# EAGLE design CAN-BUS Shield  v1.2 (EAGLE 7.1.0)
DESCRIPTION: microOBD 200 OBD-II Module; HW_REV: 1.4; PCB_REV: C; PCB_SPEC1: Layer Count: 4; PCB_SPEC2: Size: 1.3" x 0.59"; PCB_SPEC3: Finish Thickness: 0.049" - 0.052"; PCB_SPEC4: Copper Weight: 1oz; TITLE: STM1120

## Sheet 1 of 2
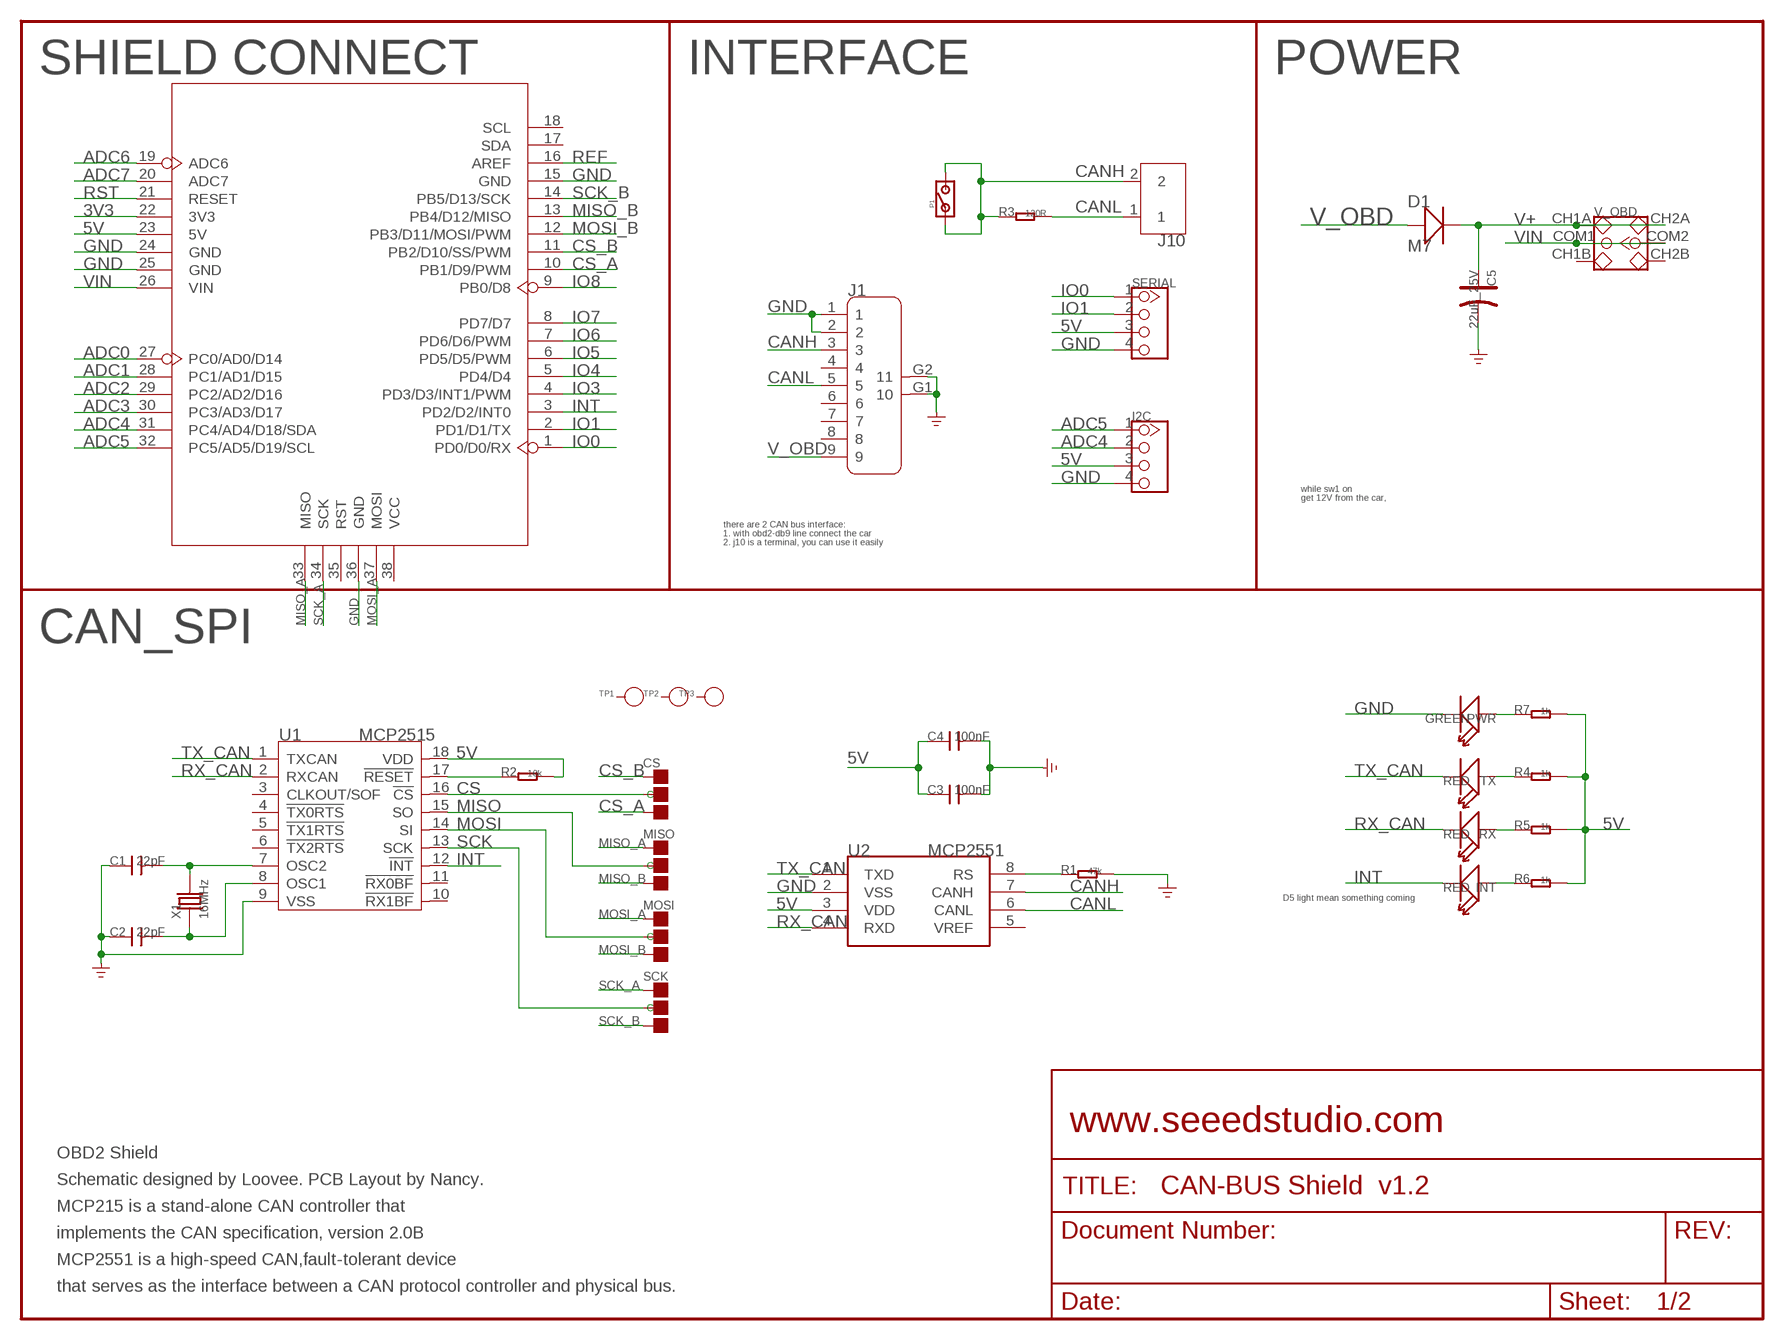
[diagram p0: schematic, sheet 1]

### Parts
C1  22pF  C-0603  [0603]
C2  22pF  C-0603  [0603]
C3  100nF  C-0603  [0603]
C4  100nF  C-0603  [0603]
C5  22uF_25V  CAP-ELECTRO-B  [ELECTRO-SMD-B-4.8MM]
CS  PAD-JUMPER-3P-40*40  [3P-SMD-4.1X1.5]
D1  M7  D-SMA  [D2010]
I2C  TWIG-4P-2.0-2.0  [4P-2.0]
INT  RED  LED'0603'  [LED-0603]
J1  DB9'MEAL'  [DB9-MEAL]
J10  SCREW-TERMINAL-2P5.0  [2P-5.0]
MISO  PAD-JUMPER-3P-40*40  [3P-SMD-4.1X1.5]
MOSI  PAD-JUMPER-3P-40*40  [3P-SMD-4.1X1.5]
P1  PAD-JUMPER-2P  [2P-SMD-1.78X1.27]
PWR  GREEN  LED'0603'  [LED-0603]
R1  47k  R-0603  [0603]
R2  10k  R-0603  [0603]
R3  120R  R-0603  [0603]
R4  1k  R-0603  [0603]
R5  1k  R-0603  [0603]
R6  1k  R-0603  [0603]
R7  1k  R-0603  [0603]
RX  RED  LED'0603'  [LED-0603]
SCK  PAD-JUMPER-3P-40*40  [3P-SMD-4.1X1.5]
SERIAL  TWIG-4P-2.0-2.0  [4P-2.0]
TP1  PAD-TEST-POINT'4545'  [TP_4545]
TP2  PAD-TEST-POINT'4545'  [TP_4545]
TP3  PAD-TEST-POINT'4545'  [TP_4545]
TX  RED  LED'0603'  [LED-0603]
U1  MCP2515  MCP2515-SOIC18  [SOIC18]
U2  MCP2551  MCP2551-SOIC8  [SOIC8-6.0]
U4  ARDUINO-38P'WITH/-SILK'  [ARDUINO-38P-WITH/-SILK-500519002]
V_OBD  SWITCH-2CH-6P  [6P-2CH-2.54-7.6X3.0]
X1  16MHz  CRYSTAL-HC49S  [HC49/S]

### Nets
3V3: U4.22(3V3)
5V: C3.1 C4.1 I2C.3 R2.2 R4.2 R5.2 R6.2 R7.2 SERIAL.3 U1.18(VDD) U2.3(VDD) U4.23(5V)
ADC0: U4.27(PC0/AD0/D14)
ADC1: U4.28(PC1/AD1/D15)
ADC2: U4.29(PC2/AD2/D16)
ADC3: U4.30(PC3/AD3/D17)
ADC4: I2C.2 U4.31(PC4/AD4/D18/SDA)
ADC5: I2C.1 U4.32(PC5/AD5/D19/SCL)
ADC6: U4.19(ADC6)
ADC7: U4.20(ADC7)
CANH: J1.3 J10.2 P1.1 P1.2 R3.1 U2.7(CANH)
CANL: J1.5 J10.1 R3.2 U2.6(CANL)
CS: CS.MM(C) U1.16(!CS)
CS_A: CS.11(R) U4.10(PB1/D9/PWM)
CS_B: CS.00(L) U4.11(PB2/D10/SS/PWM)
GND: C1.1 C2.1 C3.2 C4.2 C5.- I2C.4 J1.1 J1.2 J1.G1 J1.G2 PWR.- R1.2 SERIAL.4 U1.9(VSS) U2.2(VSS) U4.15(GND) U4.24(GND) U4.25(GND) U4.36(GND)
INT: INT.- U1.12(!INT) U4.3(PD2/D2/INT0)
IO0: SERIAL.1 U4.1(PD0/D0/RX)
IO1: SERIAL.2 U4.2(PD1/D1/TX)
IO3: U4.4(PD3/D3/INT1/PWM)
IO4: U4.5(PD4/D4)
IO5: U4.6(PD5/D5/PWM)
IO6: U4.7(PD6/D6/PWM)
IO7: U4.8(PD7/D7)
IO8: U4.9(PB0/D8)
MISO: MISO.MM(C) U1.15(SO)
MISO_A: MISO.00(L) U4.33(MISO)
MISO_B: MISO.11(R) U4.13(PB4/D12/MISO)
MOSI: MOSI.MM(C) U1.14(SI)
MOSI_A: MOSI.00(L) U4.37(MOSI)
MOSI_B: MOSI.11(R) U4.12(PB3/D11/MOSI/PWM)
N$1: PWR.+ R7.1
N$2: R4.1 TX.+
N$15: R5.1 RX.+
N$16: C1.2 U1.7(OSC2) X1.2
N$17: C2.2 U1.8(OSC1) X1.1
N$19: INT.+ R6.1
N$20: R1.1 U2.8(RS)
REF: U4.16(AREF)
RST: U4.21(RESET)
RST_N: R2.1 U1.17(!RESET)
RX_CAN: RX.- U1.2(RXCAN) U2.4(RXD)
SCK: SCK.MM(C) U1.13(SCK)
SCK_A: SCK.00(L) U4.34(SCK)
SCK_B: SCK.11(R) U4.14(PB5/D13/SCK)
TX_CAN: TX.- U1.1(TXCAN) U2.1(TXD)
V+: C5.+ D1.- V_OBD.CH1A V_OBD.CH2A
V_OBD: D1.+ J1.9
VIN: U4.26(VIN) V_OBD.COM1 V_OBD.COM2
Unconnected: J1.4 J1.6 J1.7 J1.8 TP1.T TP2.T TP3.T U1.3(CLKOUT/SOF) U1.4(!TX0RTS) U1.5(!TX1RTS) U1.6(!TX2RTS) U1.10(!RX1BF) U1.11(!RX0BF) U2.5(VREF) U4.17(SDA) U4.18(SCL) U4.35(RST) U4.38(VCC) V_OBD.CH1B V_OBD.CH2B

### Notes on the sheet
- SHIELD CONNECT | INTERFACE | POWER
- while sw1 on
- get 12V from the car,
- there are 2 CAN bus interface:
- 1. with obd2-db9 line connect the car
- 2. j10 is a terminal, you can use it easily
- CAN_SPI
- D5 light mean something coming
- www.seeedstudio.com
- OBD2 Shield
- Schematic designed by Loovee. PCB Layout by Nancy.
- MCP215 is a stand-alone CAN controller that
- implements the CAN specification, version 2.0B
- MCP2551 is a high-speed CAN,fault-tolerant device
- that serves as the interface between a CAN protocol controller and physical bus.

## Sheet 2 of 2

## Library data of the parts
C1-C4 = Discrete:C*: Ceramic Capacitors
C5 = Discrete:CAP*: Electrolytic Capacitors,Tantalum Capacitors and Super Capacitors
CS MISO MOSI SCK = Discrete:PAD-JUMPER-3P
D1 = Discrete:D*
I2C SERIAL = Connector:TWIG-4P-2.0
INT PWR RX TX = Discrete:LED*
J1 = Connector:DB9
J10 = Connector:SCREW-TERMINAL-2P
P1 = Discrete:PAD-JUMPER-2P
R1-R7 = Discrete:R*
TP1-TP3 = Discrete:PAD-TEST-POINT; PARTNO: DNP
U1 = IC:MCP2515: Stand-Alone CAN Controller With SPI Interface
U2 = IC:MCP2551: High-Speed CAN Transceiver http://ww1.microchip.com/downloads/en/devicedoc/21667f.pdf
U4 = moudle:ARDUINO-38P
V_OBD = Discrete:SWITCH-2CH-6P
X1 = Discrete:CRYSTAL*: CRYSTAL

## Net classes
0 default: width 0.152 mm, drill 0.305 mm, clearance 0.152 mm

## Board
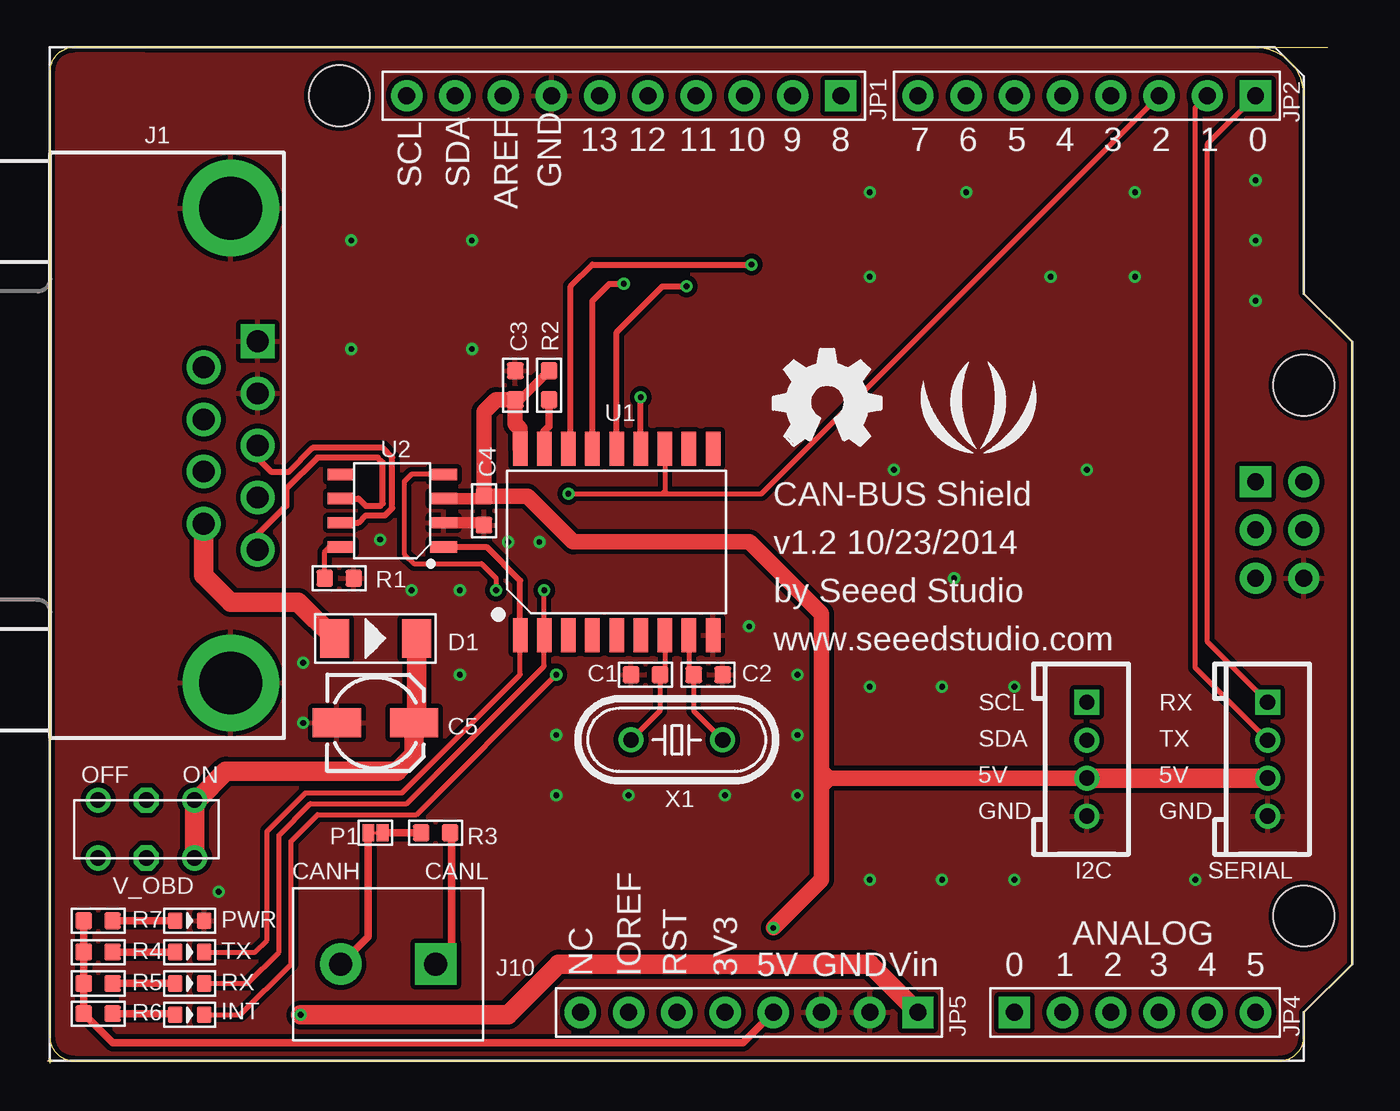
[diagram p1: board, top side]
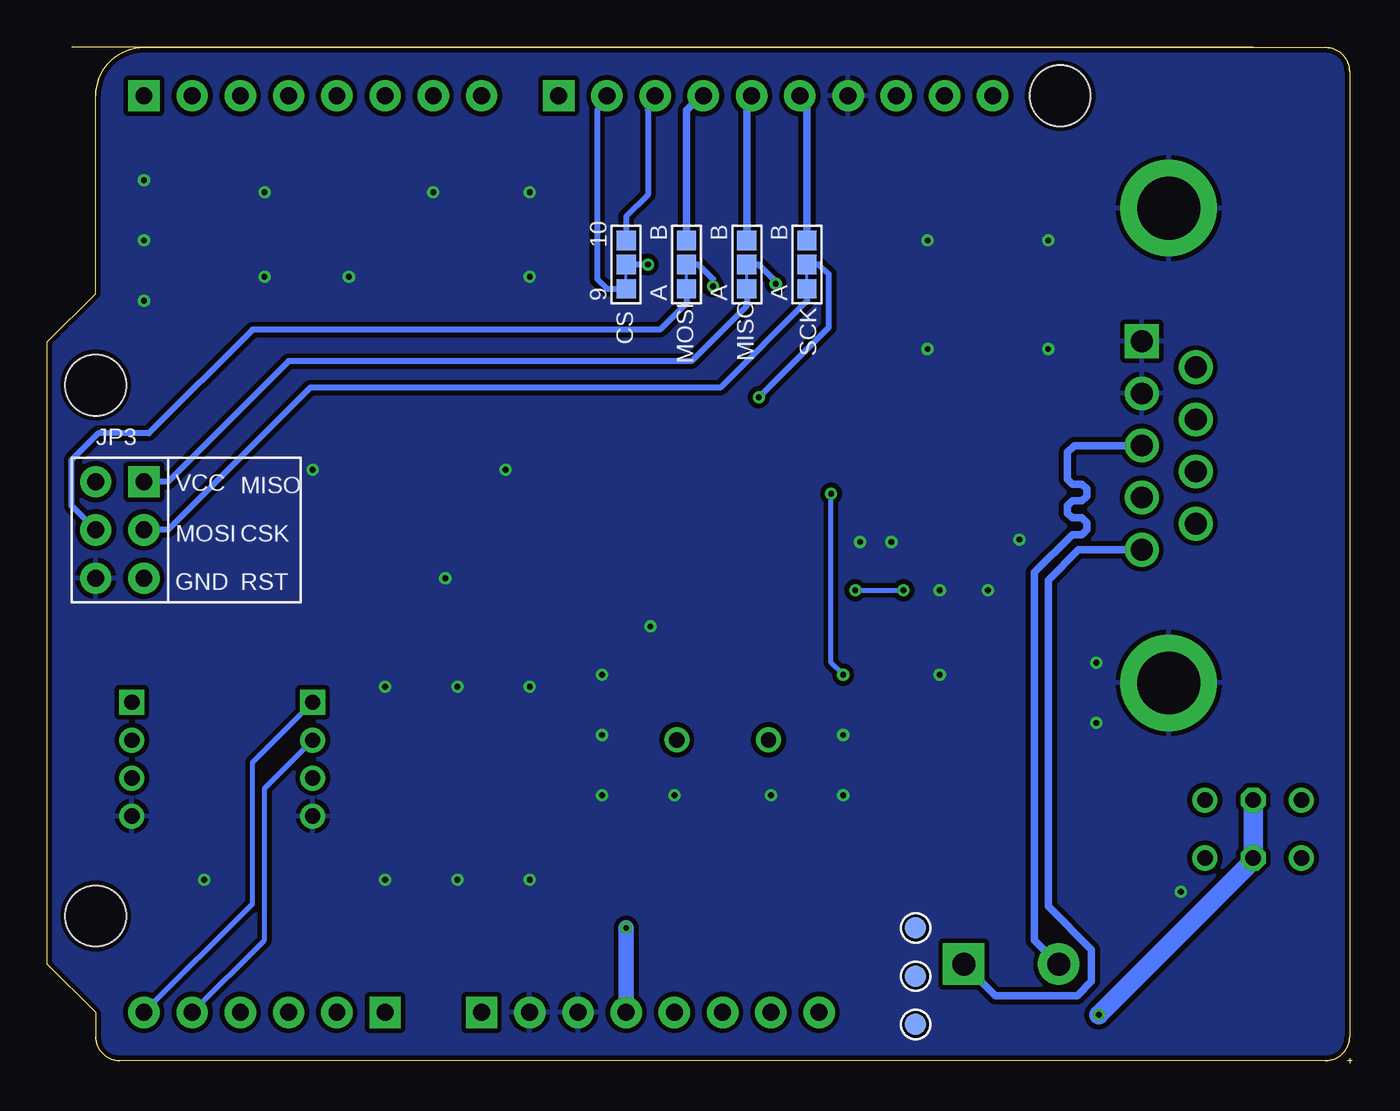
[diagram p2: board, bottom side, seen from below]

Size 68.71 x 53.47 mm. Coordinates in mm from the lower left corner, seen from the top.
Outline: 66.17,1.4 arc-90 64.9,0.13
Outline: 1.4,0.13 arc-90 0.13,1.4
Outline: 0.13,52.2 arc-90 1.4,53.47
Outline: 63.63,53.47 arc-90 66.17,50.93
Outline: 5.21,53.47 67.44,53.47
Outline: 0.13,1.4 arc90 1.4,0.13
Outline: 64.9,0.13 arc90 66.17,1.4
Outline: 1.4,53.47 arc90 0.13,52.2
Outline: 0.13,1.4 arc90 1.4,0.13
Outline: 64.9,0.13 arc90 66.17,1.4
Outline: 66.17,50.93 arc90 63.63,53.47
Outline: 66.17,1.4 66.17,2.67 68.71,5.21 68.71,37.97 66.17,40.51 66.17,50.93
Outline: 66.17,1.4 arc-90 64.9,0.13
Outline: 63.63,53.47 1.4,53.47
Outline: 1.4,53.47 arc90 0.13,52.2
Outline: 0.13,52.2 0.13,1.4
Outline: 0.13,1.4 arc90 1.4,0.13
Outline: 66.17,50.93 arc90 63.63,53.47
Outline: 1.4,0.13 64.9,0.13
Outline: 0,0.13 0.25,0.13
Outline: 0.13,0.25 0.13,0
Copper layers (1*16): Top 0.035mm / dielectric 1.5mm / Bottom 0.035mm
Design rules "SeeedStudio_2layer_DRU_no_angle_20140221 *": minimum track width 6mil, minimum drill 12mil, track to track 6mil, track to pad 6mil, pad to pad 6mil, via to via 6mil, smd to smd 0mil, copper to edge 10mil, drill to drill 10mil, minimum pad ring 10mil, minimum via ring 6mil, stop-mask expansion 2mil, vias tented up to drill 100mil, thermal gap 10mil

### Footprints (pad centres in the part's own frame; a part is rotated, then mirrored left to right if it is on the bottom)
0603 = smd 0.889 x 0.889: 1 -0.762,0; 2 0.762,0
ELECTRO-SMD-B-4.8MM = smd 2.54 x 1.524: + 2.032,0; - -2.032,0
3P-SMD-4.1X1.5 = smd 1.016 x 1.016: 00 -1.27,0; 11 1.27,0; MM 0,0
D2010 = smd 1.524 x 2.032: + -2.159,0; - 2.159,0
4P-2.0 = drill 0.8 pad 1.27 square: 1 -3,0 | drill 0.8 pad 1.27: 2 -1,0; 3 1,0; 4 3,0
LED-0603 = smd 0.762 x 0.889: + -0.762,0; - 0.762,0
DB9-MEAL = drill 1.143 pad 1.778 square: 1 -5.486,1.422 | drill 1.143 pad 1.778: 2 -2.743,1.422; 3 0,1.422; 4 2.743,1.422; 5 5.486,1.422; 6 -4.115,-1.422; 7 -1.372,-1.422; 8 1.372,-1.422; 9 4.115,-1.422 | drill 3.302 pad 5.08: G1 12.497,0; G2 -12.497,0
2P-5.0 = drill 1.2 pad 2.184 square: 1 0,0 | drill 1.2 pad 2.184: 2 5,0
2P-SMD-1.78X1.27 = smd 0.889 x 0.61: 1 0,0.381; 2 0,-0.381
TP_4545 = smd 1.143 x 1.143: T 0,0
SOIC18 = smd 0.762 x 1.778: 1 -5.08,-4.915; 2 -3.81,-4.915; 3 -2.54,-4.915; 4 -1.27,-4.915; 5 0,-4.915; 6 1.27,-4.915; 7 2.54,-4.915; 8 3.81,-4.915; 9 5.08,-4.915; 10 5.08,4.915; 11 3.81,4.915; 12 2.54,4.915; 13 1.27,4.915; 14 0,4.915; 15 -1.27,4.915; 16 -2.54,4.915; 17 -3.81,4.915; 18 -5.08,4.915
SOIC8-6.0 = smd 0.6 x 1.4: 1 -1.905,-2.7; 2 -0.635,-2.7; 3 0.635,-2.7; 4 1.905,-2.7; 5 1.905,2.7; 6 0.635,2.7; 7 -0.635,2.7; 8 -1.905,2.7
ARDUINO-38P-WITH/-SILK-500519002 = drill 0.889 pad 1.651 square: 1 63.5,50.8; 9 41.656,50.8; 26 45.72,2.54; 27 50.8,2.54; 33 63.5,30.48 | drill 0.889 pad 1.651: 2 60.96,50.8; 3 58.42,50.8; 4 55.88,50.8; 5 53.34,50.8; 6 50.8,50.8; 7 48.26,50.8; 8 45.72,50.8; 10 39.116,50.8; 11 36.576,50.8; 12 34.036,50.8; 13 31.496,50.8; 14 28.956,50.8; 15 26.416,50.8; 16 23.876,50.8; 17 21.336,50.8; 18 18.796,50.8; 19 27.94,2.54; 20 30.48,2.54; 21 33.02,2.54; 22 35.56,2.54; 23 38.1,2.54; 24 40.64,2.54; 25 43.18,2.54; 28 53.34,2.54; 29 55.88,2.54; 30 58.42,2.54; 31 60.96,2.54; 32 63.5,2.54; 34 63.5,27.94; 35 63.5,25.4; 36 66.04,25.4; 37 66.04,27.94; 38 66.04,30.48 | hole 3.2: 15.24,50.8; 66.04,35.56; 66.04,7.62
6P-2CH-2.54-7.6X3.0 = drill 0.813 pad 1.27: CH1A -1.524,2.54; CH1B -1.524,-2.54; CH2A 1.524,2.54; CH2B 1.524,-2.54 | drill 0.813 pad 1.27 octagon: COM1 -1.524,0; COM2 1.524,0
HC49/S = drill 0.813: 1 -2.413,0; 2 2.413,0

### Placement (x,y rotation side)
C1  31.5,20.45 0 top
C2  34.8,20.45 180 top
C3  24.64,35.69 90 top
C4  22.99,29.08 270 top
C5  17.27,17.91 0 top
CS  38.23,42.04 270 bottom
D1  17.27,22.35 0 top
I2C  54.74,16 270 top
INT  7.49,2.54 0 top
J1  9.65,32.51 270 top
J10  20.45,5.21 180 top
MISO  31.88,42.04 90 bottom
MOSI  35.05,42.04 90 bottom
P1  17.27,12.13 90 top
PWR  7.49,7.49 0 top
R1  15.37,25.53 0 top
R2  26.42,35.69 90 top
R3  20.45,12.13 0 top
R4  2.67,5.84 180 top
R5  2.67,4.19 180 top
R6  2.67,2.6 180 top
R7  2.67,7.49 180 top
RX  7.49,4.19 0 top
SCK  28.7,42.04 90 bottom
SERIAL  64.26,16 270 top
TP1  22.99,7.11 0 bottom
TP2  22.99,4.57 0 bottom
TP3  22.99,2.03 0 bottom
TX  7.49,5.84 0 top
U1  29.97,27.43 0 top
U2  18.16,29.08 90 top
U4  0.13,0.13 0 top
U$1  [LOGO_SILK]  49.02,33.78 0 top
U$2  [OSHW_FILLX200_NOTEXT]  38.23,32.51 0 top
V_OBD  5.21,12.32 270 top
X1  33.15,17.02 180 top

### Tracks (layer width: path | path; a pad name or v marks a point on that pad's centre or on a via)
5V  (via drill 0.3 pad 0.64)
  Top 0.254: R4.2 1.91,5.71
  Top 0.406: 1.91,5.71 R5.2 R6.2 3.43,1.08 36.64,1.08 U4.23 | R4.2 R7.2
  Top 0.508: C3.1 24.89,34.93 R2.2
  Top 0.61: U2.3 23.11,29.72 C4.1
  Top 0.813: 40.77,15.37 40.77,23.64 36.98,27.43 27.69,27.43 25.27,29.84 C4.1 22.99,34.29 23.62,34.93 C3.1 24.64,33.66 24.89,33.4 U1.18 | 40.77,15.37 40.77,15.11 | 40.77,15.11 40.77,14.61 | I2C.3 41.16,15 | 41.13,15 40.88,15 40.77,15.11 | 41.16,15 41.13,15 | 41.13,15 40.77,15.37 | 41.16,15 40.77,14.61 | 40.77,14.61 40.77,9.65 v38.23,7.11
  Top 1.016: I2C.3 SERIAL.3
  Bottom 0.813: v38.23,7.11 U4.23
ADC4
  Bottom 0.254: U4.31 57.28,6.48 57.28,14.46 I2C.2
ADC5
  Bottom 0.254: U4.32 57.91,8.38 57.91,15.83 I2C.1
CANH
  Top 0.152: P1.1 P1.2
  Top 0.305: U2.7 16.38,28.45 16.76,28.83 17.78,28.83 18.16,29.21 18.16,31.88 17.65,32.39 13.97,32.39 12.7,31.11 11.81,31.11 11.07,31.85 J1.3
  Top 0.406: P1.1 16.89,6.65 J10.2 | R3.1 P1.2
  Bottom 0.406: 11.05,32.51 J1.3 14.63,32.51 14.99,32.15 14.99,30.73 14.73,30.48 14.22,30.48 13.97,30.23 13.97,29.84 14.22,29.59 14.73,29.59 14.99,29.34 14.99,28.96 14.73,28.7 14.22,28.7 13.97,28.45 13.97,28.07 14.22,27.81 14.73,27.81 16.72,25.83 16.72,6.48 J10.2
CANL
  Top 0.305: U2.6 16.38,29.72 16.76,29.34 17.53,29.34 17.65,29.46 17.65,31.62 17.4,31.88 14.22,31.88 12.57,30.23 12.57,29.34 11.07,27.84 J1.5
  Top 0.406: R3.2 21.27,12.13 21.27,6.03 J10.1
  Bottom 0.406: J1.5 14.4,27.03 16,25.43 16,8.26 13.72,5.97 13.72,4.32 14.48,3.56 18.8,3.56 J10.1
CS  (via drill 0.3 pad 0.64)
  Top 0.305: U1.16 27.43,33.02 27.56,33.15 27.56,40.89 28.7,42.04 v37.08,42.04
  Bottom 0.305: v37.08,42.04 CS.MM
CS_A
  Bottom 0.152: CS.11 38.23,42.04
  Bottom 0.305: U4.10 39.24,50.67 39.75,50.16 39.75,41.28 39.24,40.77 CS.11
CS_B
  Bottom 0.305: U4.11 36.7,50.55 37.08,50.16 37.08,45.72 38.23,44.58 CS.00
GND  (via drill 0.3 pad 0.64)
  Top 0.61: U2.2 22.86,28.45 C4.2
  other vias: 24.26,27.43 17.53,27.56 25.91,27.43 13.46,17.91 21.72,24.89 19.18,24.89 9.02,9.02 26.8,17.27 26.8,14.1 30.61,14.1 39.5,17.27 39.5,20.45 36.96,22.99 35.69,14.1 39.5,14.1 16,43.31 22.35,43.31 16,37.59 22.35,37.59 43.31,41.4 57.28,45.85 57.28,41.4 63.63,46.48 63.63,40.13 43.31,45.85 43.31,9.65 47.12,9.65 50.93,9.65 43.31,19.81 47.12,19.81 50.93,19.81 54.74,31.24 44.58,31.24 47.75,25.53 48.39,45.85 60.45,9.65 52.83,41.4 63.63,43.31 13.46,21.08 21.72,20.45
  pour Top (isolate 0.254): 0.13,53.47 68.71,53.47 68.71,0.13 0.13,0.13
  pour Bottom (isolate 0.254): 0.13,53.47 68.71,53.47 68.71,0.13 0.13,0.13
INT  (via drill 0.3 pad 0.64)
  Top 0.254: INT.- 10.16,2.54 12.83,5.21 12.83,11.68 14.22,13.08 19.43,13.08 v26.8,20.45 | U1.12 32.51,29.97 | 32.64,29.97 37.59,29.97 U4.3 | v27.43,29.97 32.39,29.97 | 32.39,29.97 32.51,29.97 | 32.51,29.97 32.64,29.97 | 32.39,29.97 32.51,30.1 32.64,29.97
  Bottom 0.254: v26.8,20.45 27.43,21.08 v27.43,29.97
IO0
  Top 0.254: SERIAL.1 61.09,22.18 61.09,48.39 U4.1
IO1
  Top 0.254: SERIAL.2 60.45,20.81 60.45,50.29 U4.2
MISO  (via drill 0.3 pad 0.64)
  Top 0.305: U1.15 28.7,40.13 29.59,41.02 v30.35,41.02
  Bottom 0.305: v30.35,41.02 30.35,41.15 31.24,42.04 MISO.MM 31.75,41.91
MISO_A
  Bottom 0.152: MISO.00 31.88,42.04
  Bottom 0.305: MISO.00 31.88,39.88 34.8,36.96 56.01,36.96 62.36,30.61 U4.33
MISO_B
  Bottom 0.406: U4.13 31.62,50.8 31.88,50.55 MISO.11
MOSI  (via drill 0.3 pad 0.64)
  Top 0.305: U1.14 29.97,38.48 32.39,40.89 v33.66,40.89
  Bottom 0.305: v33.66,40.89 33.66,41.28 34.42,42.04 MOSI.MM
MOSI_A
  Bottom 0.152: MOSI.00 35.05,42.04
  Bottom 0.305: MOSI.00 35.05,40.01 36.45,38.61 57.91,38.61 63.37,33.15 66.04,33.15 67.44,31.75 67.44,29.34 U4.37
MOSI_B
  Bottom 0.406: U4.12 34.29,50.93 35.05,50.16 MOSI.11
N$1
  Top 0.406: R7.1 PWR.+
N$2
  Top 0.406: R4.1 TX.+
N$15
  Top 0.406: R5.1 RX.+
N$16
  Top 0.254: U1.7 32.51,20.7 C1.2 32.26,18.54 X1.2
N$17
  Top 0.254: U1.8 33.78,20.7 C2.2 34.04,18.54 X1.1
N$19
  Top 0.406: R6.1 6.67,2.6 INT.+
N$20
  Top 0.254: R1.1 14.61,26.92 14.86,27.18 U2.8 15.56,27.18
RST_N
  Top 0.406: R2.1 26.42,33.53 26.16,33.27 U1.17
RX_CAN  (via drill 0.3 pad 0.64)
  Top 0.254: RX.- 10.54,4.19 12.19,5.84 12.19,12 13.84,13.65 18.92,13.65 26.16,20.89 U1.2 v26.16,24.89 | U2.4 19.18,30.99 18.8,30.61 18.8,26.8 19.3,26.29 22.86,26.29 23.62,25.53 v23.62,24.89
  Bottom 0.254: v26.16,24.89 v23.62,24.89
SCK  (via drill 0.3 pad 0.64)
  Top 0.305: U1.13 v31.24,35.05
  Bottom 0.305: v31.24,35.05 31.24,35.18 31.11,35.18 27.56,38.73 27.56,41.53 28.07,42.04 SCK.MM
SCK_A
  Bottom 0.152: SCK.00 28.7,42.04
  Bottom 0.305: SCK.00 28.7,40.13 33.27,35.56 54.86,35.56 62.36,28.07 U4.34
SCK_B
  Bottom 0.406: U4.14 28.7,50.55 SCK.11
TX_CAN
  Top 0.254: TX.- 10.92,5.84 11.56,6.48 11.56,12.19 13.59,14.22 18.67,14.22 24.89,20.45 U1.1
  Top 0.305: U2.1 23.11,27.18 24.89,25.4 U1.1
V+
  Top 1.016: V_OBD.CH2A V_OBD.CH1A 7.87,13.84 9.4,15.37 18.41,15.37 19.3,16.26 19.3,17.65 | C5.+ 19.3,17.65 | D1.- 19.43,17.78 19.3,17.65
V_OBD
  Top 1.016: J1.9 8.23,25.68 9.65,24.26 13.21,24.26 D1.+
VIN  (via drill 0.3 pad 0.64)
  Top 1.016: v13.34,2.54 24.26,2.54 26.92,5.21 43.31,5.21 U4.26
  Bottom 1.016: V_OBD.COM1 V_OBD.COM2 5.21,10.67 v13.34,2.54

### Text on the board
tPlace: CAN-BUS Shield | v1.2 10/23/2014 | by Seeed Studio | www.seeedstudio.com | SCL | RX | SDA | TX | OFF | ON | 5V | 5V | GND | GND | CANH | CANL
bPlace: B | B | B | 10 | A | A | A | 9 | MISO | VCC | CSK | MOSI | RST | GND